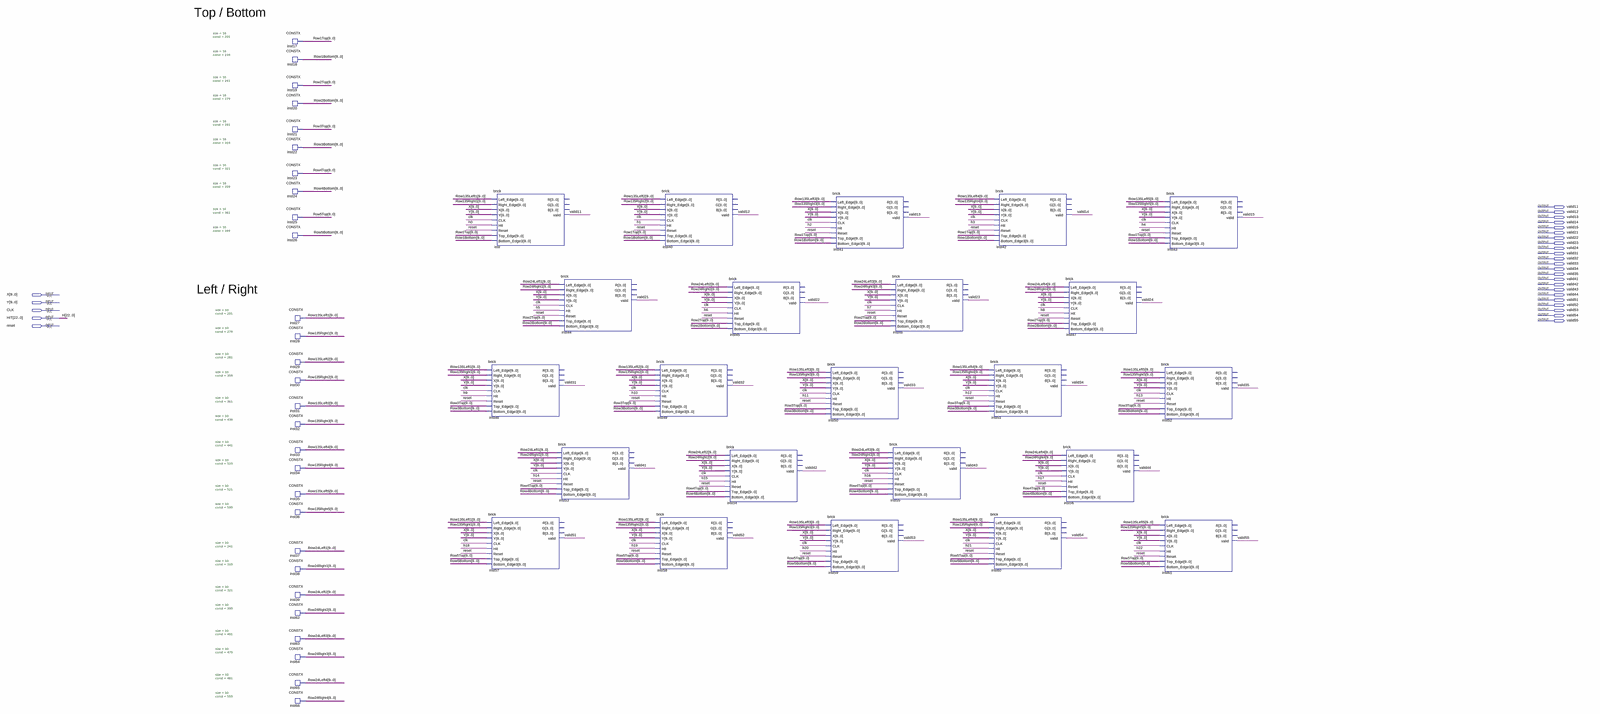
[diagram p0: schematic sheet, whole]
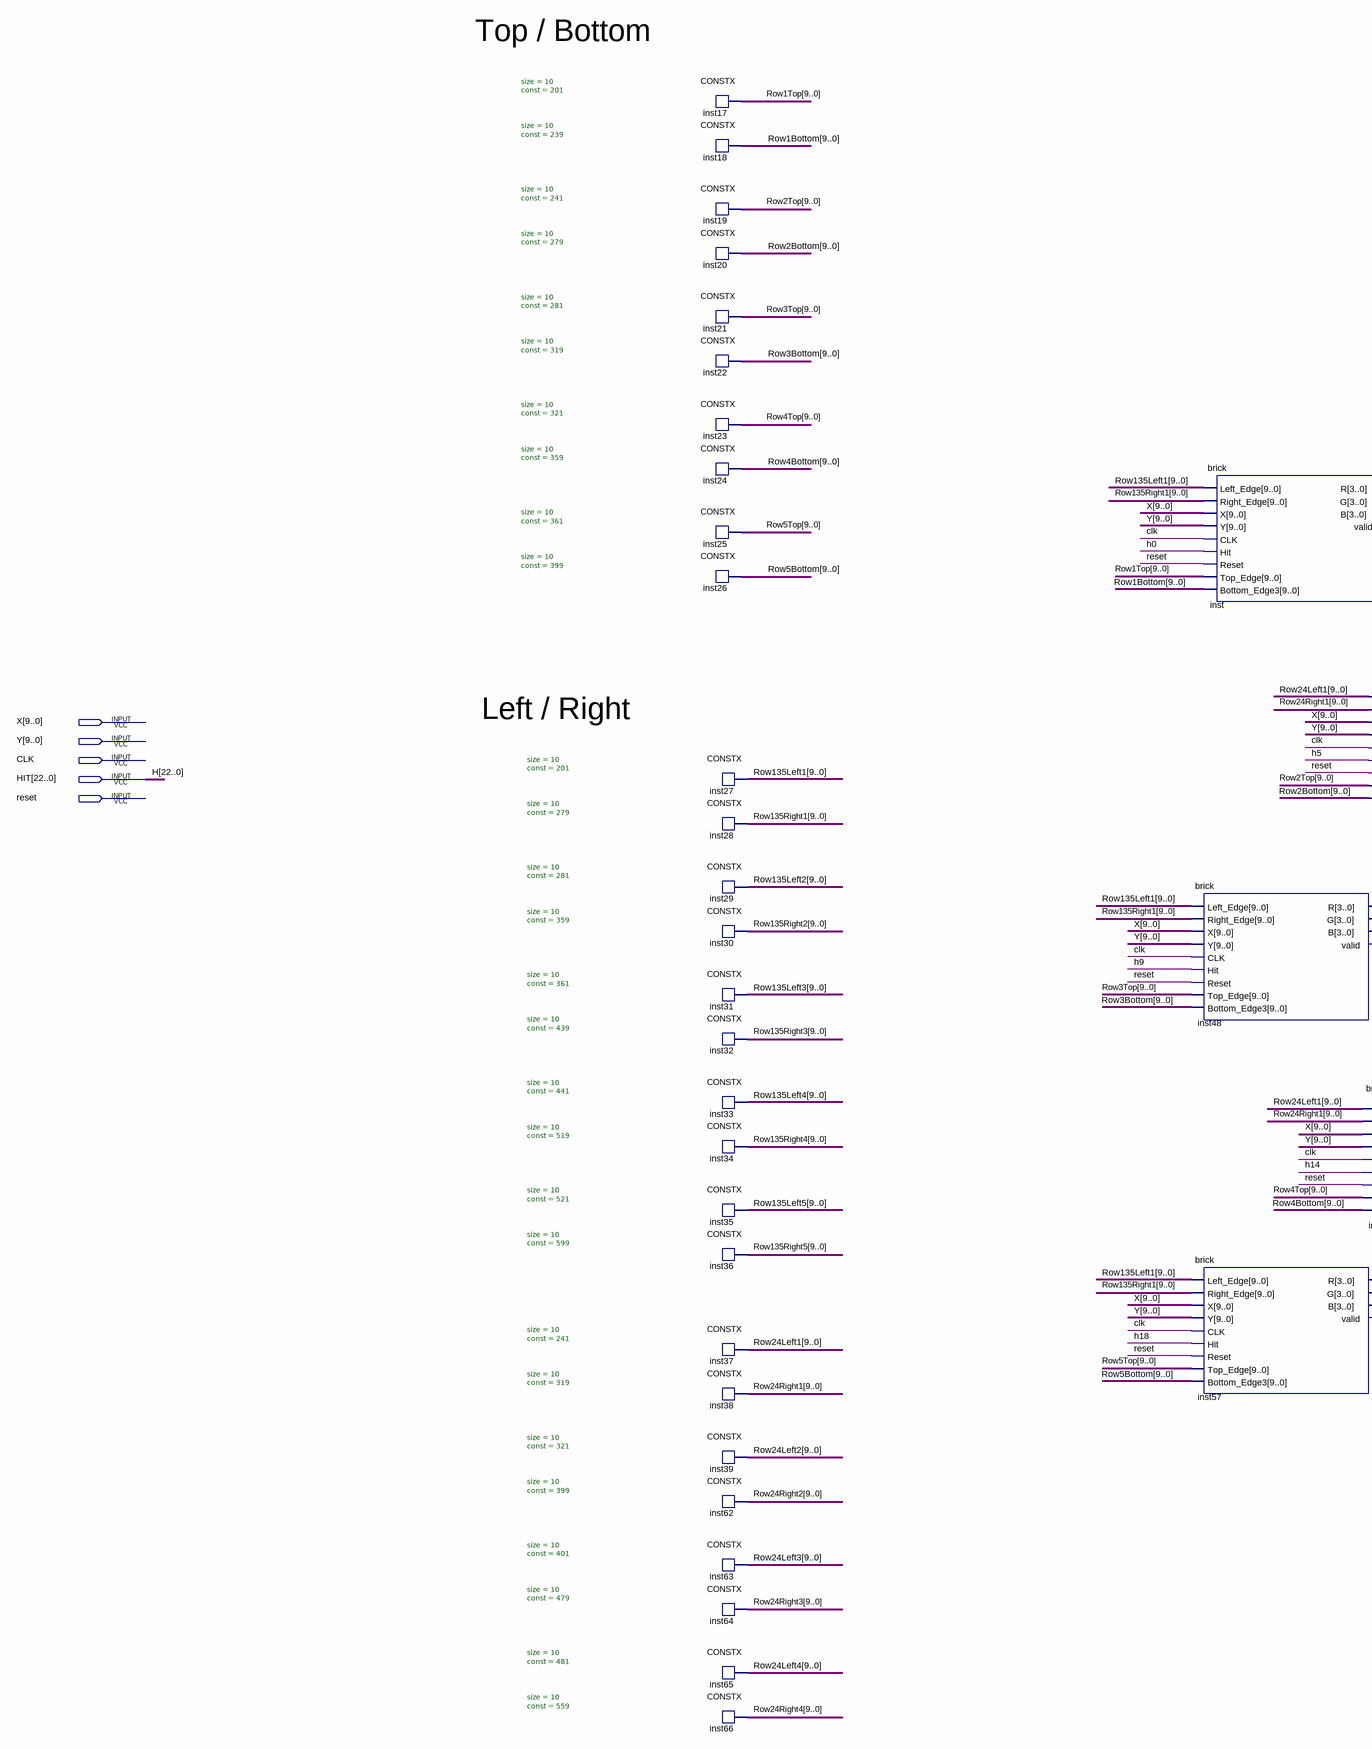
[diagram p1: schematic sheet, left part]
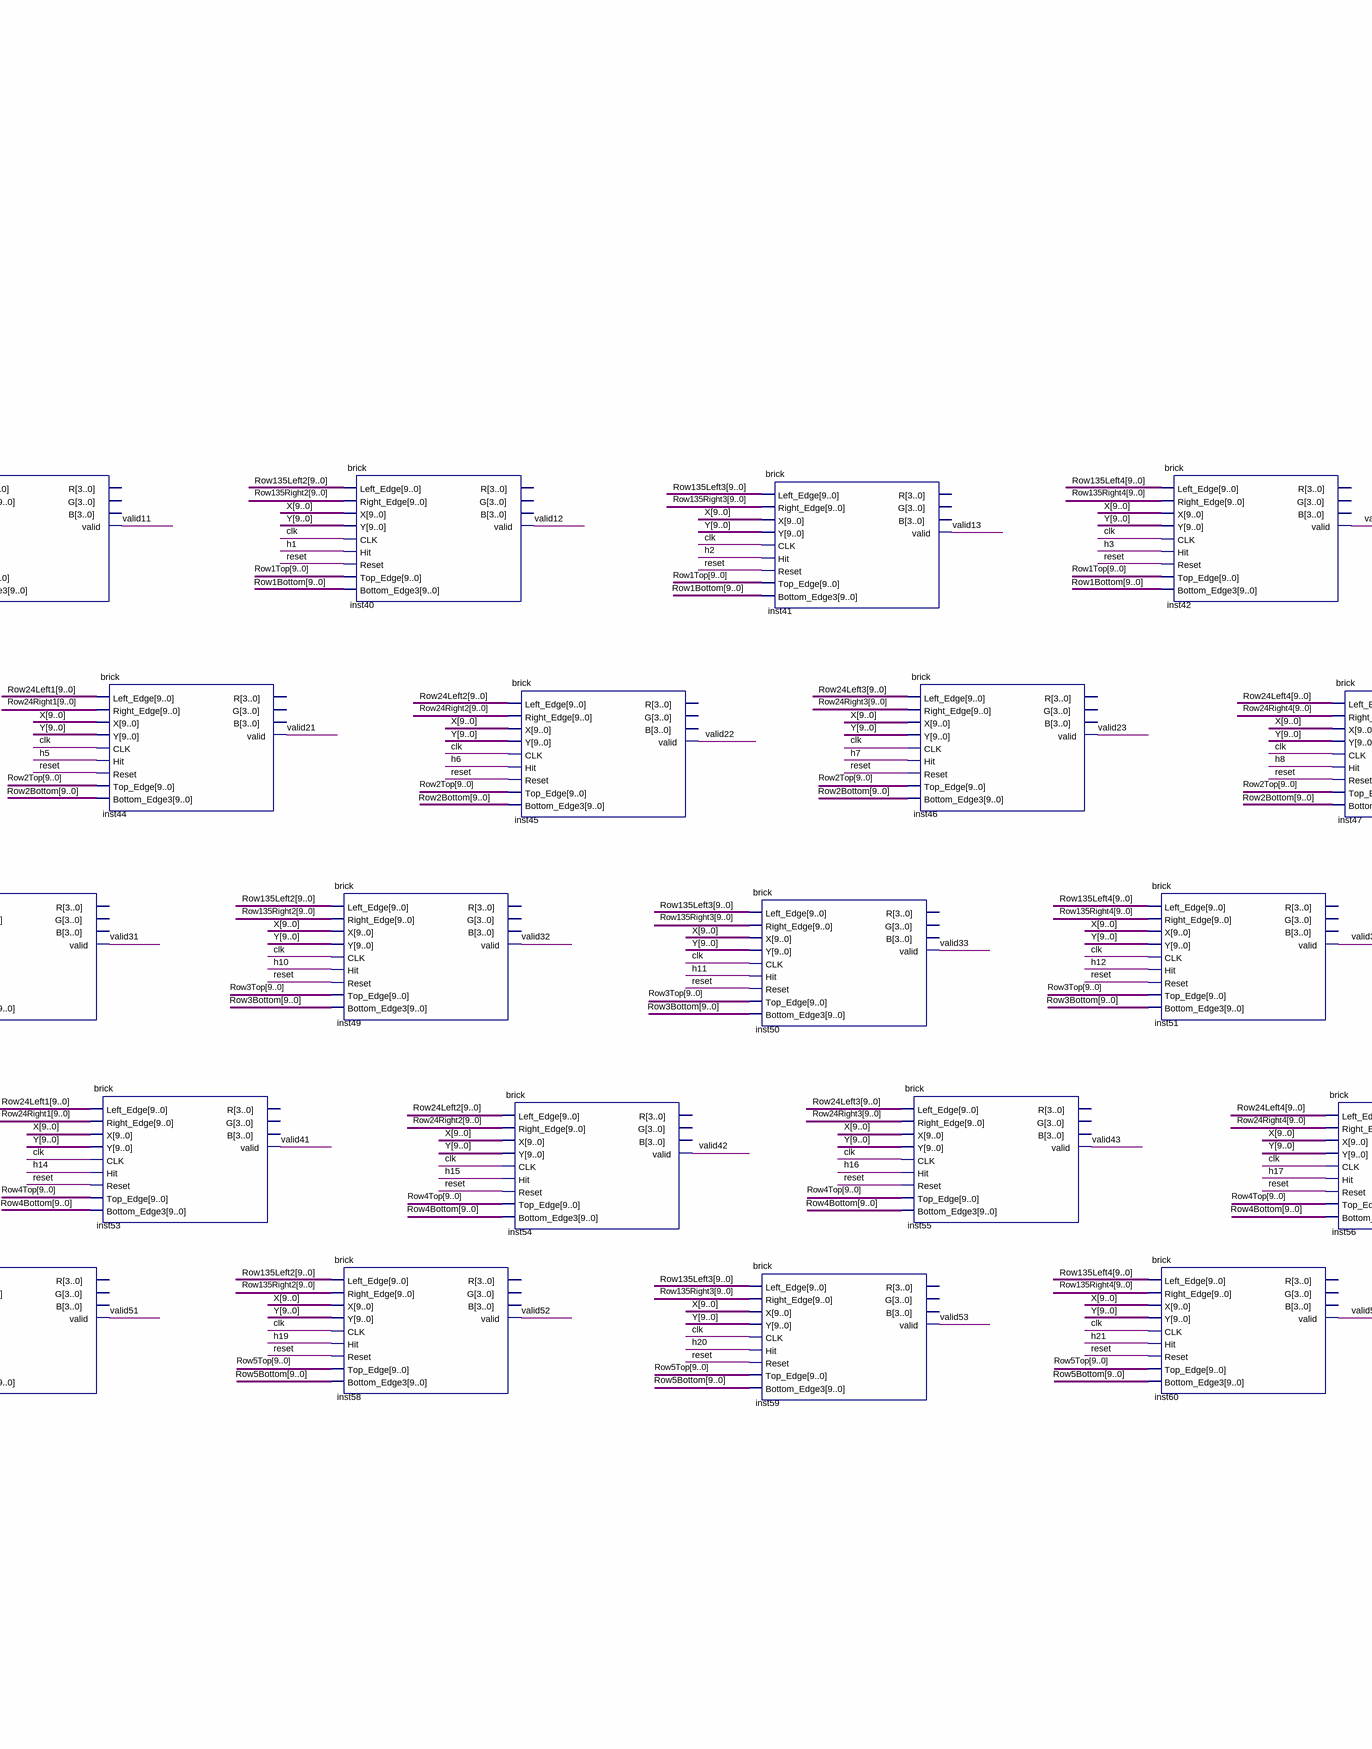
[diagram p2: schematic sheet, centre part]
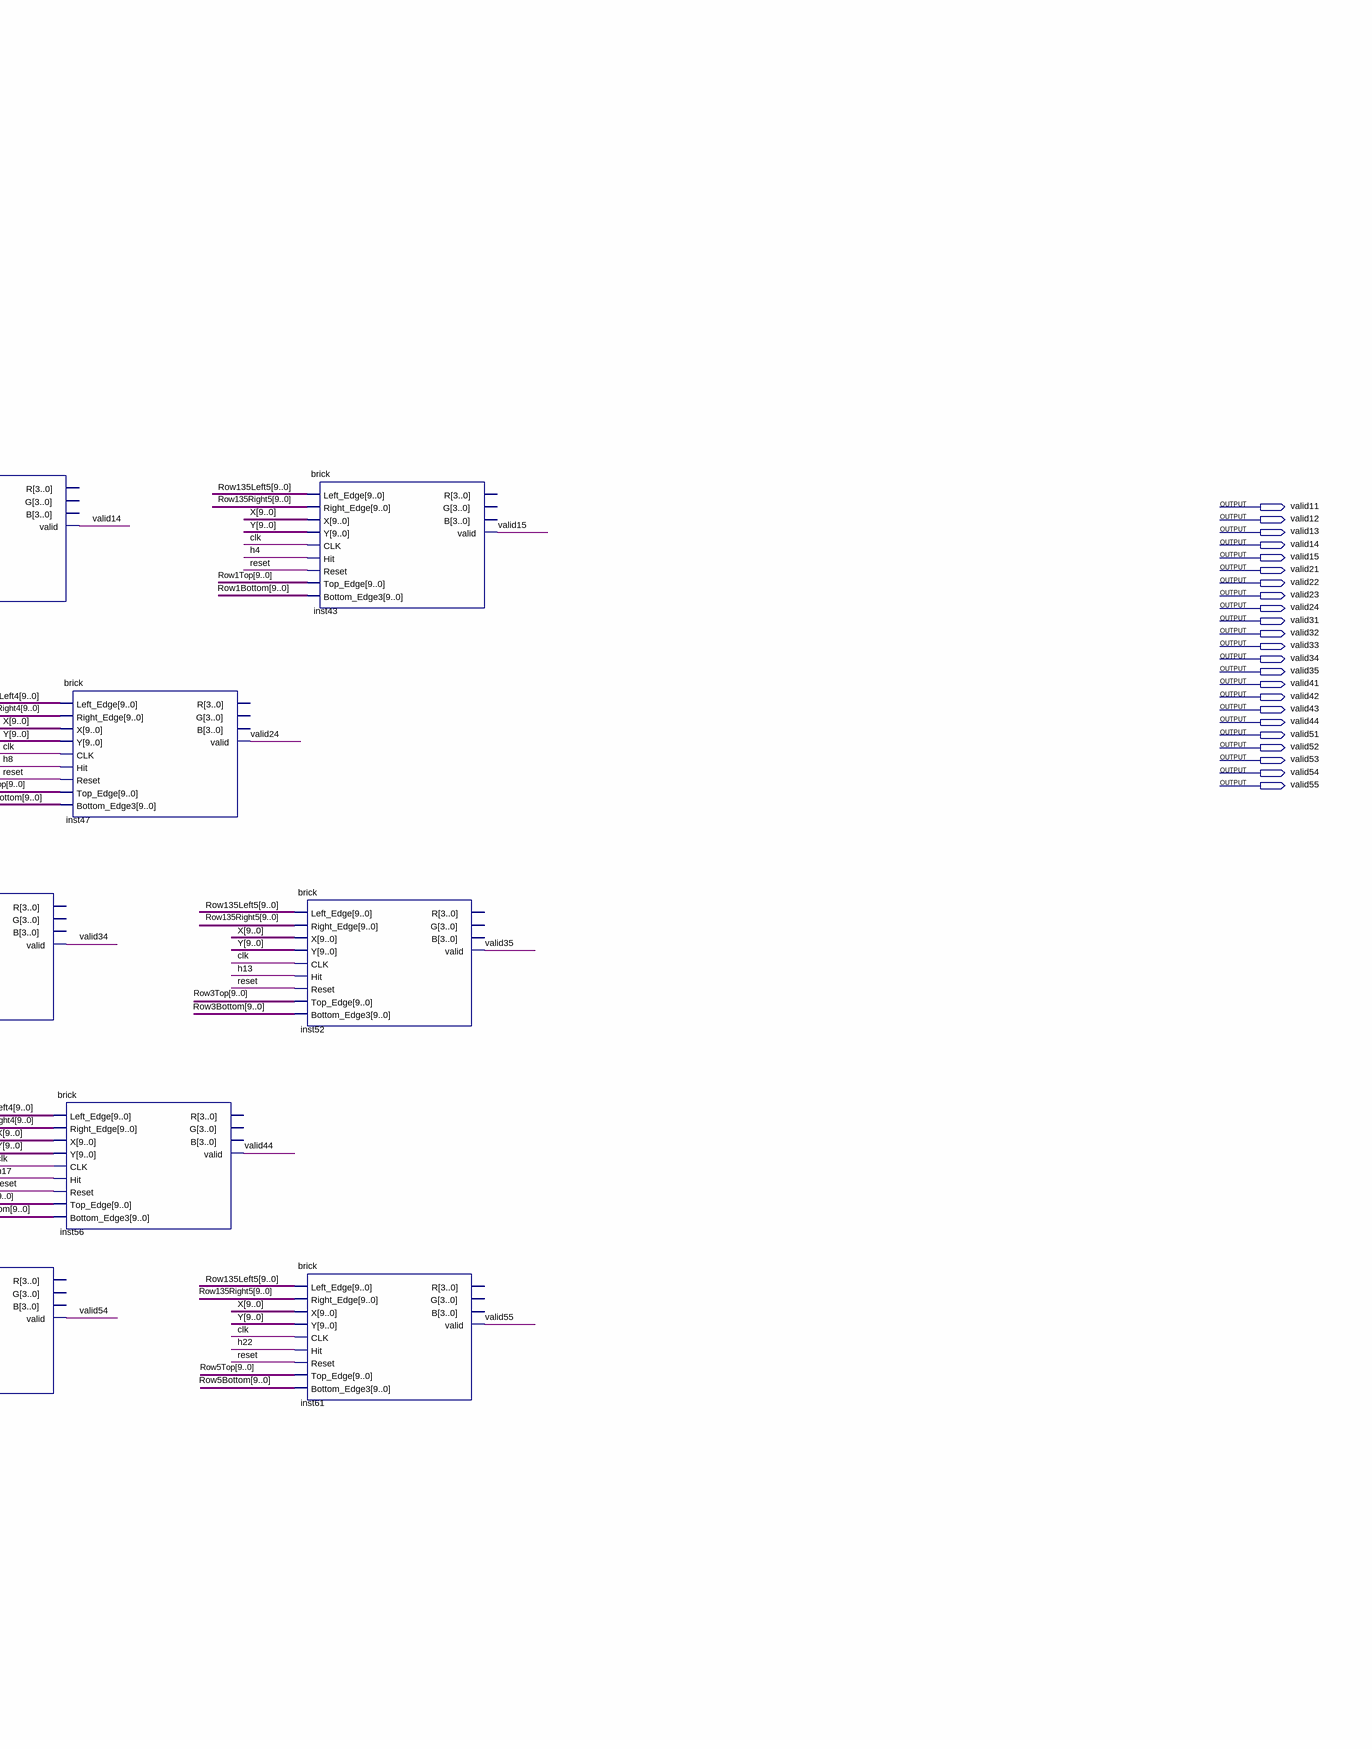
[diagram p3: schematic sheet, right part]
// Quartus schematic bricks.bdf as structural Verilog: 51 symbols, 28 pins
module bricks (
  input  [9:0] X,
  input  [9:0] Y,
  input  CLK,
  input  [22:0] HIT,
  input  reset,
  output valid11,
  output valid12,
  output valid13,
  output valid14,
  output valid15,
  output valid21,
  output valid22,
  output valid23,
  output valid24,
  output valid31,
  output valid32,
  output valid33,
  output valid34,
  output valid35,
  output valid41,
  output valid42,
  output valid43,
  output valid44,
  output valid51,
  output valid52,
  output valid53,
  output valid54,
  output valid55
);

  wire [9:0] Row1Bottom, Row1Top, Row2Bottom, Row2Top, Row3Bottom, Row3Top, Row4Bottom, Row4Top, Row5Bottom,
       Row5Top, Row24Left1, Row24Left2, Row24Left3, Row24Left4, Row24Right1, Row24Right2, Row24Right3,
       Row24Right4, Row135Left1, Row135Left2, Row135Left3, Row135Left4, Row135Left5, Row135Right1,
       Row135Right2, Row135Right3, Row135Right4, Row135Right5;

  CONSTX #(.size(10), .\const (201)) inst17 (.data(Row1Top));
  CONSTX #(.size(10), .\const (239)) inst18 (.data(Row1Bottom));
  CONSTX #(.size(10), .\const (241)) inst19 (.data(Row2Top));
  CONSTX #(.size(10), .\const (279)) inst20 (.data(Row2Bottom));
  CONSTX #(.size(10), .\const (281)) inst21 (.data(Row3Top));
  CONSTX #(.size(10), .\const (319)) inst22 (.data(Row3Bottom));
  CONSTX #(.size(10), .\const (321)) inst23 (.data(Row4Top));
  CONSTX #(.size(10), .\const (359)) inst24 (.data(Row4Bottom));
  CONSTX #(.size(10), .\const (361)) inst25 (.data(Row5Top));
  CONSTX #(.size(10), .\const (399)) inst26 (.data(Row5Bottom));
  CONSTX #(.size(10), .\const (201)) inst27 (.data(Row135Left1));
  CONSTX #(.size(10), .\const (279)) inst28 (.data(Row135Right1));
  CONSTX #(.size(10), .\const (281)) inst29 (.data(Row135Left2));
  CONSTX #(.size(10), .\const (359)) inst30 (.data(Row135Right2));
  CONSTX #(.size(10), .\const (361)) inst31 (.data(Row135Left3));
  CONSTX #(.size(10), .\const (439)) inst32 (.data(Row135Right3));
  CONSTX #(.size(10), .\const (441)) inst33 (.data(Row135Left4));
  CONSTX #(.size(10), .\const (519)) inst34 (.data(Row135Right4));
  CONSTX #(.size(10), .\const (521)) inst35 (.data(Row135Left5));
  CONSTX #(.size(10), .\const (599)) inst36 (.data(Row135Right5));
  CONSTX #(.size(10), .\const (241)) inst37 (.data(Row24Left1));
  CONSTX #(.size(10), .\const (319)) inst38 (.data(Row24Right1));
  CONSTX #(.size(10), .\const (321)) inst39 (.data(Row24Left2));
  CONSTX #(.size(10), .\const (399)) inst62 (.data(Row24Right2));
  CONSTX #(.size(10), .\const (401)) inst63 (.data(Row24Left3));
  CONSTX #(.size(10), .\const (479)) inst64 (.data(Row24Right3));
  CONSTX #(.size(10), .\const (481)) inst65 (.data(Row24Left4));
  CONSTX #(.size(10), .\const (559)) inst66 (.data(Row24Right4));
  brick inst (
    .Left_Edge(Row135Left1), .Right_Edge(Row135Right1), .X(X), .Y(Y), .CLK(CLK), .Hit(HIT[0]), .Reset(reset),
    .Top_Edge(Row1Top), .Bottom_Edge3(Row1Bottom), .valid(valid11));  // open: R, G, B
  brick inst48 (
    .Left_Edge(Row135Left1), .Right_Edge(Row135Right1), .X(X), .Y(Y), .CLK(CLK), .Hit(HIT[9]), .Reset(reset),
    .Top_Edge(Row3Top), .Bottom_Edge3(Row3Bottom), .valid(valid31));  // open: R, G, B
  brick inst57 (
    .Left_Edge(Row135Left1), .Right_Edge(Row135Right1), .X(X), .Y(Y), .CLK(CLK), .Hit(HIT[18]),
    .Reset(reset), .Top_Edge(Row5Top), .Bottom_Edge3(Row5Bottom), .valid(valid51));  // open: R, G, B
  brick inst44 (
    .Left_Edge(Row24Left1), .Right_Edge(Row24Right1), .X(X), .Y(Y), .CLK(CLK), .Hit(HIT[5]), .Reset(reset),
    .Top_Edge(Row2Top), .Bottom_Edge3(Row2Bottom), .valid(valid21));  // open: R, G, B
  brick inst53 (
    .Left_Edge(Row24Left1), .Right_Edge(Row24Right1), .X(X), .Y(Y), .CLK(CLK), .Hit(HIT[14]), .Reset(reset),
    .Top_Edge(Row4Top), .Bottom_Edge3(Row4Bottom), .valid(valid41));  // open: R, G, B
  brick inst49 (
    .Left_Edge(Row135Left2), .Right_Edge(Row135Right2), .X(X), .Y(Y), .CLK(CLK), .Hit(HIT[10]),
    .Reset(reset), .Top_Edge(Row3Top), .Bottom_Edge3(Row3Bottom), .valid(valid32));  // open: R, G, B
  brick inst58 (
    .Left_Edge(Row135Left2), .Right_Edge(Row135Right2), .X(X), .Y(Y), .CLK(CLK), .Hit(HIT[19]),
    .Reset(reset), .Top_Edge(Row5Top), .Bottom_Edge3(Row5Bottom), .valid(valid52));  // open: R, G, B
  brick inst40 (
    .Left_Edge(Row135Left2), .Right_Edge(Row135Right2), .X(X), .Y(Y), .CLK(CLK), .Hit(HIT[1]), .Reset(reset),
    .Top_Edge(Row1Top), .Bottom_Edge3(Row1Bottom), .valid(valid12));  // open: R, G, B
  brick inst45 (
    .Left_Edge(Row24Left2), .Right_Edge(Row24Right2), .X(X), .Y(Y), .CLK(CLK), .Hit(HIT[6]), .Reset(reset),
    .Top_Edge(Row2Top), .Bottom_Edge3(Row2Bottom), .valid(valid22));  // open: R, G, B
  brick inst54 (
    .Left_Edge(Row24Left2), .Right_Edge(Row24Right2), .X(X), .Y(Y), .CLK(CLK), .Hit(HIT[15]), .Reset(reset),
    .Top_Edge(Row4Top), .Bottom_Edge3(Row4Bottom), .valid(valid42));  // open: R, G, B
  brick inst41 (
    .Left_Edge(Row135Left3), .Right_Edge(Row135Right3), .X(X), .Y(Y), .CLK(CLK), .Hit(HIT[2]), .Reset(reset),
    .Top_Edge(Row1Top), .Bottom_Edge3(Row1Bottom), .valid(valid13));  // open: R, G, B
  brick inst50 (
    .Left_Edge(Row135Left3), .Right_Edge(Row135Right3), .X(X), .Y(Y), .CLK(CLK), .Hit(HIT[11]),
    .Reset(reset), .Top_Edge(Row3Top), .Bottom_Edge3(Row3Bottom), .valid(valid33));  // open: R, G, B
  brick inst59 (
    .Left_Edge(Row135Left3), .Right_Edge(Row135Right3), .X(X), .Y(Y), .CLK(CLK), .Hit(HIT[20]),
    .Reset(reset), .Top_Edge(Row5Top), .Bottom_Edge3(Row5Bottom), .valid(valid53));  // open: R, G, B
  brick inst46 (
    .Left_Edge(Row24Left3), .Right_Edge(Row24Right3), .X(X), .Y(Y), .CLK(CLK), .Hit(HIT[7]), .Reset(reset),
    .Top_Edge(Row2Top), .Bottom_Edge3(Row2Bottom), .valid(valid23));  // open: R, G, B
  brick inst55 (
    .Left_Edge(Row24Left3), .Right_Edge(Row24Right3), .X(X), .Y(Y), .CLK(CLK), .Hit(HIT[16]), .Reset(reset),
    .Top_Edge(Row4Top), .Bottom_Edge3(Row4Bottom), .valid(valid43));  // open: R, G, B
  brick inst51 (
    .Left_Edge(Row135Left4), .Right_Edge(Row135Right4), .X(X), .Y(Y), .CLK(CLK), .Hit(HIT[12]),
    .Reset(reset), .Top_Edge(Row3Top), .Bottom_Edge3(Row3Bottom), .valid(valid34));  // open: R, G, B
  brick inst60 (
    .Left_Edge(Row135Left4), .Right_Edge(Row135Right4), .X(X), .Y(Y), .CLK(CLK), .Hit(HIT[21]),
    .Reset(reset), .Top_Edge(Row5Top), .Bottom_Edge3(Row5Bottom), .valid(valid54));  // open: R, G, B
  brick inst42 (
    .Left_Edge(Row135Left4), .Right_Edge(Row135Right4), .X(X), .Y(Y), .CLK(CLK), .Hit(HIT[3]), .Reset(reset),
    .Top_Edge(Row1Top), .Bottom_Edge3(Row1Bottom), .valid(valid14));  // open: R, G, B
  brick inst47 (
    .Left_Edge(Row24Left4), .Right_Edge(Row24Right4), .X(X), .Y(Y), .CLK(CLK), .Hit(HIT[8]), .Reset(reset),
    .Top_Edge(Row2Top), .Bottom_Edge3(Row2Bottom), .valid(valid24));  // open: R, G, B
  brick inst56 (
    .Left_Edge(Row24Left4), .Right_Edge(Row24Right4), .X(X), .Y(Y), .CLK(CLK), .Hit(HIT[17]), .Reset(reset),
    .Top_Edge(Row4Top), .Bottom_Edge3(Row4Bottom), .valid(valid44));  // open: R, G, B
  brick inst43 (
    .Left_Edge(Row135Left5), .Right_Edge(Row135Right5), .X(X), .Y(Y), .CLK(CLK), .Hit(HIT[4]), .Reset(reset),
    .Top_Edge(Row1Top), .Bottom_Edge3(Row1Bottom), .valid(valid15));  // open: R, G, B
  brick inst52 (
    .Left_Edge(Row135Left5), .Right_Edge(Row135Right5), .X(X), .Y(Y), .CLK(CLK), .Hit(HIT[13]),
    .Reset(reset), .Top_Edge(Row3Top), .Bottom_Edge3(Row3Bottom), .valid(valid35));  // open: R, G, B
  brick inst61 (
    .Left_Edge(Row135Left5), .Right_Edge(Row135Right5), .X(X), .Y(Y), .CLK(CLK), .Hit(HIT[22]),
    .Reset(reset), .Top_Edge(Row5Top), .Bottom_Edge3(Row5Bottom), .valid(valid55));  // open: R, G, B

  // Other names for the same wires on the sheet: H[22:0] = HIT; h0 = HIT[0]; h1 = HIT[1]; h2 = HIT[2]; h3 = HIT[3];
  //   h4 = HIT[4]; h5 = HIT[5]; h6 = HIT[6]; h7 = HIT[7]; h8 = HIT[8]; h9 = HIT[9]; h10 = HIT[10]; h11 = HIT[11];
  //   h12 = HIT[12]; h13 = HIT[13]; h14 = HIT[14]; h15 = HIT[15]; h16 = HIT[16]; h17 = HIT[17]; h18 = HIT[18];
  //   h19 = HIT[19]; h20 = HIT[20]; h21 = HIT[21]; h22 = HIT[22]

  // Notes on the sheet:
  //   Top / Bottom
  //   Left / Right
endmodule
